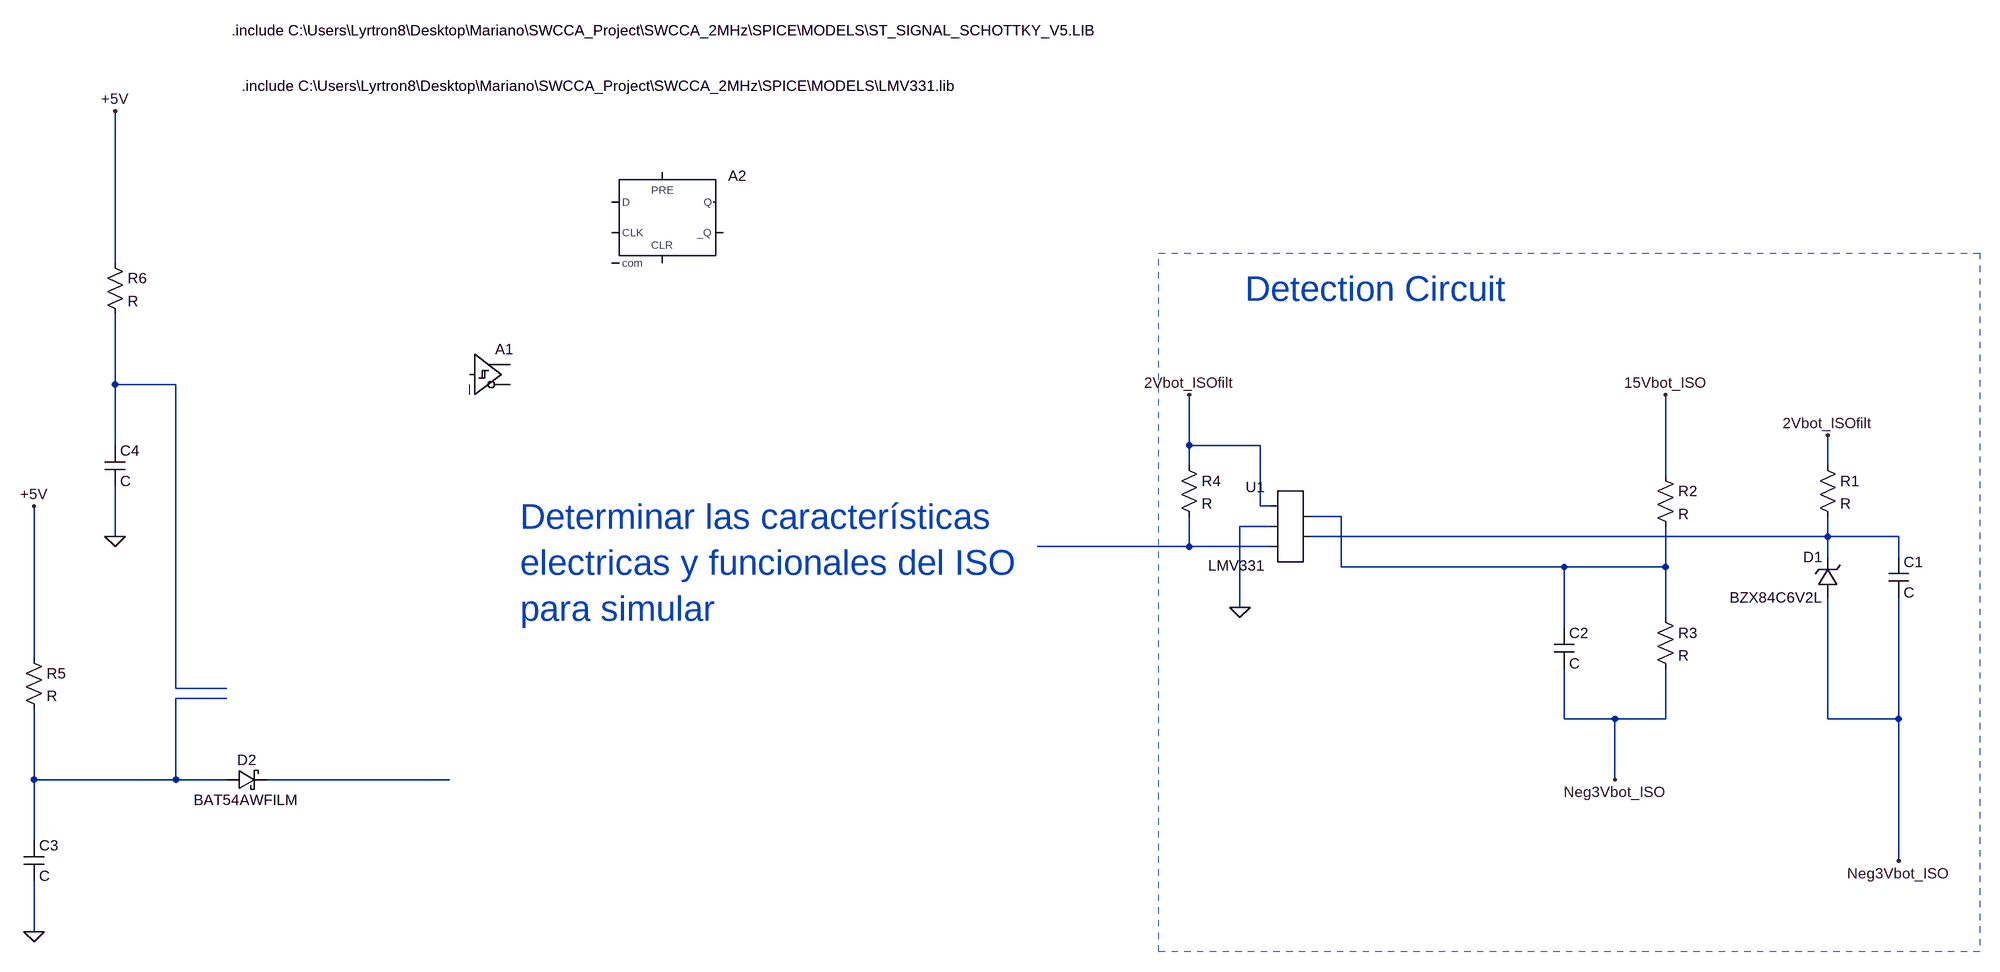
[diagram p0: schematic protection_ISO.asc]
protection_ISO.asc, the LTspice schematic file:
Version 4
SHEET 1 2068 2516
WIRE -880 1312 -880 1072
WIRE -880 1504 -880 1392
WIRE -784 1504 -880 1504
WIRE -880 1600 -880 1504
WIRE 816 1600 816 1520
WIRE 928 1600 816 1600
WIRE 816 1632 816 1600
WIRE 1824 1632 1824 1584
WIRE 1568 1648 1568 1520
WIRE 928 1696 928 1600
WIRE 944 1696 928 1696
WIRE 1056 1712 1008 1712
WIRE 944 1728 896 1728
WIRE -880 1744 -880 1664
WIRE 1824 1744 1824 1712
WIRE 1824 1744 1008 1744
WIRE 1936 1744 1824 1744
WIRE 816 1760 816 1712
WIRE 816 1760 576 1760
WIRE 944 1760 816 1760
WIRE 1824 1776 1824 1744
WIRE 1936 1776 1936 1744
WIRE 1056 1792 1056 1712
WIRE 1408 1792 1056 1792
WIRE 1568 1792 1568 1728
WIRE 1568 1792 1408 1792
WIRE 896 1856 896 1728
WIRE 1568 1872 1568 1792
WIRE 1408 1888 1408 1792
WIRE -1008 1936 -1008 1696
WIRE -784 1984 -784 1504
WIRE -704 1984 -784 1984
WIRE -704 2000 -784 2000
WIRE 1408 2032 1408 1952
WIRE 1488 2032 1408 2032
WIRE 1568 2032 1568 1952
WIRE 1568 2032 1488 2032
WIRE 1824 2032 1824 1840
WIRE 1936 2032 1936 1840
WIRE 1936 2032 1824 2032
WIRE -1008 2128 -1008 2016
WIRE -784 2128 -784 2000
WIRE -784 2128 -1008 2128
WIRE -704 2128 -784 2128
WIRE -352 2128 -640 2128
WIRE 1488 2128 1488 2032
WIRE -1008 2224 -1008 2128
WIRE 1936 2256 1936 2032
WIRE -1008 2368 -1008 2288
FLAG 1824 1584 2Vbot_ISOfilt
FLAG 1936 2256 Neg3Vbot_ISO
FLAG 1568 1520 15Vbot_ISO
FLAG 1488 2128 Neg3Vbot_ISO
FLAG 816 1520 2Vbot_ISOfilt
FLAG 896 1856 0
FLAG -1008 2368 0
FLAG -1008 1696 +5V
FLAG -880 1744 0
FLAG -880 1072 +5V
SYMBOL res 1808 1616 R0
SYMATTR InstName R1
SYMBOL zener 1840 1840 R180
WINDOW 0 24 64 Left 2
WINDOW 3 24 0 Left 2
SYMATTR InstName D1
SYMATTR Value BZX84C6V2L
SYMATTR Description Diode
SYMATTR Type diode
SYMBOL cap 1920 1776 R0
SYMATTR InstName C1
SYMBOL AutoGenerated\\LMV331 976 1728 M0
SYMATTR InstName U1
SYMBOL res 1552 1632 R0
SYMATTR InstName R2
SYMBOL res 1552 1856 R0
SYMATTR InstName R3
SYMBOL cap 1392 1888 R0
SYMATTR InstName C2
SYMBOL res 800 1616 R0
SYMATTR InstName R4
SYMBOL schottky -704 2144 R270
WINDOW 0 32 32 VTop 2
WINDOW 3 0 32 VBottom 2
SYMATTR InstName D2
SYMATTR Value BAT54AWFILM
SYMATTR Description Diode
SYMATTR Type diode
SYMBOL cap -1024 2224 R0
SYMATTR InstName C3
SYMBOL res -1024 1920 R0
SYMATTR InstName R5
SYMBOL cap -896 1600 R0
SYMATTR InstName C4
SYMBOL res -896 1296 R0
SYMATTR InstName R6
SYMBOL Digital\\schmitt -320 1424 R0
SYMATTR InstName A1
SYMBOL Digital\\dflop -16 1168 R0
SYMATTR InstName A2
TEXT -680 1032 Left 2 !.include C:\\Users\\Lyrtron8\\Desktop\\Mariano\\SWCCA_Project\\SWCCA_2MHz\\SPICE\\MODELS\\LMV331.lib
TEXT 904 1352 Left 5 ;Detection Circuit
TEXT -240 1712 Left 5 ;Determinar las características \nelectricas y funcionales del ISO \npara simular
TEXT -696 944 Left 2 !.include C:\\Users\\Lyrtron8\\Desktop\\Mariano\\SWCCA_Project\\SWCCA_2MHz\\SPICE\\MODELS\\ST_SIGNAL_SCHOTTKY_V5.LIB
RECTANGLE Normal 2064 2400 768 1296 2

The netlist it stands for:
* protection_ISO.asc
R1 2Vbot_ISOfilt N003 R
D1 Neg3Vbot_ISO N003 BZX84C6V2L
C1 N003 Neg3Vbot_ISO C
* U1: LMV331 (symbol AutoGenerated\LMV331 not available, pins judged from their places): pin1=N002 pin2=N003 pin3=2Vbot_ISOfilt pin4=0 pin5=N004
R2 15Vbot_ISO N002 R
R3 N002 Neg3Vbot_ISO R
C2 N002 Neg3Vbot_ISO C
R4 2Vbot_ISOfilt N004 R
D2 N005 N006 BAT54AWFILM
C3 N005 0 C
R5 +5V N005 R
C4 N001 0 C
R6 +5V N001 R
A1 0 0 0 0 0 0 0 0 SCHMITT
A2 0 0 0 0 0 0 0 0 DFLOP
.model D D
.lib standard.dio
.include C:\Users\Lyrtron8\Desktop\Mariano\SWCCA_Project\SWCCA_2MHz\SPICE\MODELS\LMV331.lib
* Detection Circuit
* Determinar las características
* electricas y funcionales del ISO
* para simular
.include C:\Users\Lyrtron8\Desktop\Mariano\SWCCA_Project\SWCCA_2MHz\SPICE\MODELS\ST_SIGNAL_SCHOTTKY_V5.LIB
.backanno
.end